# EAGLE design Board1 (EAGLE 7.4.0)
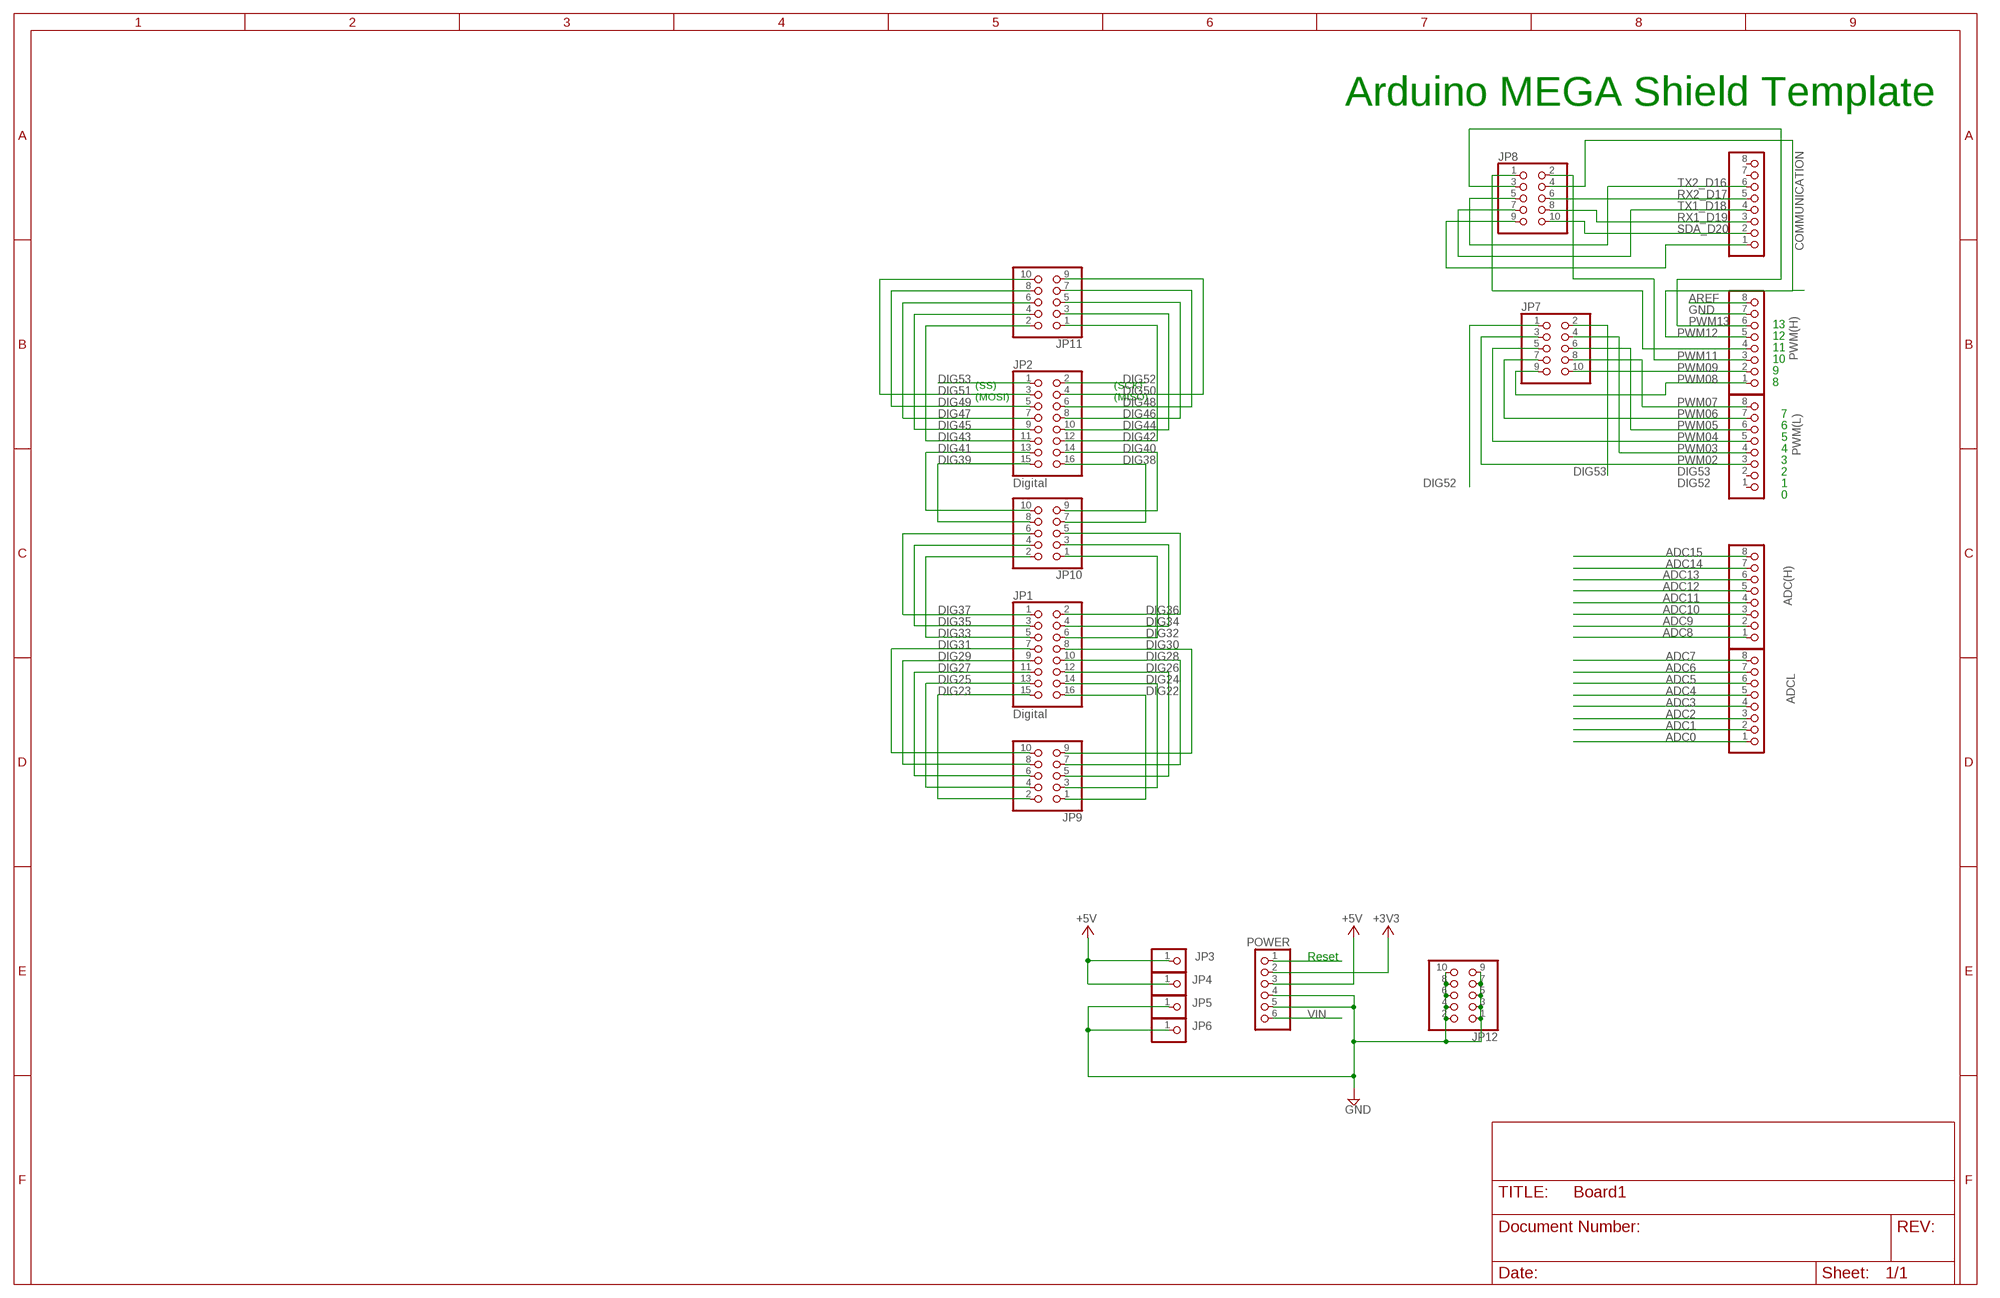
[diagram p0: schematic, sheet 1]

## Parts
ADC(H)  PINHD-1X8  [1X08]
ADCL  PINHD-1X8  [1X08]
COMMUNICATION  PINHD-1X8  [1X08]
JP1  Digital  PINHD-2X8  [2X08]
JP2  Digital  PINHD-2X8  [2X08]
JP3  PINHD-1X1  [1X01]
JP4  PINHD-1X1  [1X01]
JP5  PINHD-1X1  [1X01]
JP6  PINHD-1X1  [1X01]
JP7  PINHD-2X5SMT  [2X05_SMT]
JP8  PINHD-2X5SMT  [2X05_SMT]
JP9  PINHD-2X5SMT  [2X05_SMT]
JP10  PINHD-2X5SMT  [2X05_SMT]
JP11  PINHD-2X5SMT  [2X05_SMT]
JP12  PINHD-2X5SMT  [2X05_SMT]
POWER  PINHD-1X6  [1X06]
PWM(H)  PINHD-1X8  [1X08]
PWM(L)  PINHD-1X8  [1X08]

## Nets
+3V3 [power]: POWER.2
+5V [usbvcc]: JP3.1 JP4.1 POWER.3
ADC0: ADCL.1
ADC1: ADCL.2
ADC2: ADCL.3
ADC3: ADCL.4
ADC4: ADCL.5
ADC5: ADCL.6
ADC6: ADCL.7
ADC7: ADCL.8
ADC8: ADC(H).1
ADC9: ADC(H).2
ADC10: ADC(H).3
ADC11: ADC(H).4
ADC12: ADC(H).5
ADC13: ADC(H).6
ADC14: ADC(H).7
ADC15: ADC(H).8
AREF: PWM(H).8
DIG22: JP1.16 JP9.1
DIG23: JP1.15 JP9.2
DIG24: JP1.14 JP9.3
DIG25: JP1.13 JP9.4
DIG26 [gnd]: JP1.12 JP9.5
DIG27: JP1.11 JP9.6
DIG28: JP1.10 JP9.7
DIG29: JP1.9 JP9.8
DIG30: JP1.8 JP9.9
DIG31: JP1.7 JP9.10
DIG32: JP1.6 JP10.1
DIG33: JP1.5 JP10.2
DIG34: JP1.4 JP10.3
DIG35: JP1.3 JP10.4
DIG36: JP1.2 JP10.5
DIG37: JP1.1 JP10.6
DIG38: JP2.16 JP10.7
DIG39: JP2.15 JP10.8
DIG40: JP2.14 JP10.9
DIG41: JP2.13 JP10.10
DIG42: JP2.12 JP11.1
DIG43: JP2.11 JP11.2
DIG44: JP2.10 JP11.3
DIG45: JP2.9 JP11.4
DIG46: JP2.8 JP11.5
DIG47: JP2.7 JP11.6
DIG48: JP2.6 JP11.7
DIG49: JP2.5 JP11.8
DIG50: JP2.4 JP11.9
DIG51: JP2.3 JP11.10
DIG52: JP2.2 JP7.1
DIG53: JP2.1 JP7.2
GND [gnd]: JP5.1 JP6.1 JP12.1 JP12.2 JP12.3 JP12.4 JP12.5 JP12.6 JP12.7 JP12.8 JP12.9 JP12.10 POWER.4 POWER.5 PWM(H).7
N$1: COMMUNICATION.2 JP8.10
PWM02: JP7.3 PWM(L).3
PWM03: JP7.4 PWM(L).4
PWM04: JP7.5 PWM(L).5
PWM05: JP7.6 PWM(L).6
PWM06: JP7.7 PWM(L).7
PWM07: JP7.8 PWM(L).8
PWM08: JP7.9 PWM(H).1
PWM09: JP7.10 PWM(H).2
PWM10: JP8.1 PWM(H).4
PWM11: JP8.2 PWM(H).3
PWM12: JP8.4 PWM(H).5
PWM13: JP8.3 PWM(H).6
RESET: POWER.1
RX1_D19: COMMUNICATION.3 JP8.8
RX2_D17: COMMUNICATION.5 JP8.6
SDA_D20: COMMUNICATION.1 JP8.9
TX1_D18: COMMUNICATION.4 JP8.7
TX2_D16: COMMUNICATION.6 JP8.5
VIN [power]: POWER.6
Unconnected: COMMUNICATION.7 COMMUNICATION.8 PWM(L).1 PWM(L).2

## Notes on the sheet
- Arduino MEGA Shield Template
- 13
- 12
- 11
- 10
- 9
- (SS) | (SCK) | 8
- (MOSI) | (MISO)
- 7
- 6
- 5
- 4
- 3
- 2
- 1
- 0
- Reset

## Library data of the parts
ADC(H) ADCL COMMUNICATION PWM(H) PWM(L) = pinhead:PINHD-1X8: PIN HEADER
JP1 JP2 = pinhead:PINHD-2X8: PIN HEADER
JP3-JP6 = pinhead:PINHD-1X1: PIN HEADER
JP7-JP12 = pinhead+:PINHD-2X5: PIN HEADER
POWER = pinhead:PINHD-1X6: PIN HEADER

## Net classes
0 default: width 0.203 mm, drill 0.406 mm, clearance 0.203 mm
1 power: width 0.203 mm, drill 0.711 mm, clearance 0.203 mm
2 gnd: width 0.203 mm, drill 0.711 mm, clearance 0.203 mm
3 usbvcc: width 0.203 mm, drill 0.711 mm, clearance 0.203 mm

## Board
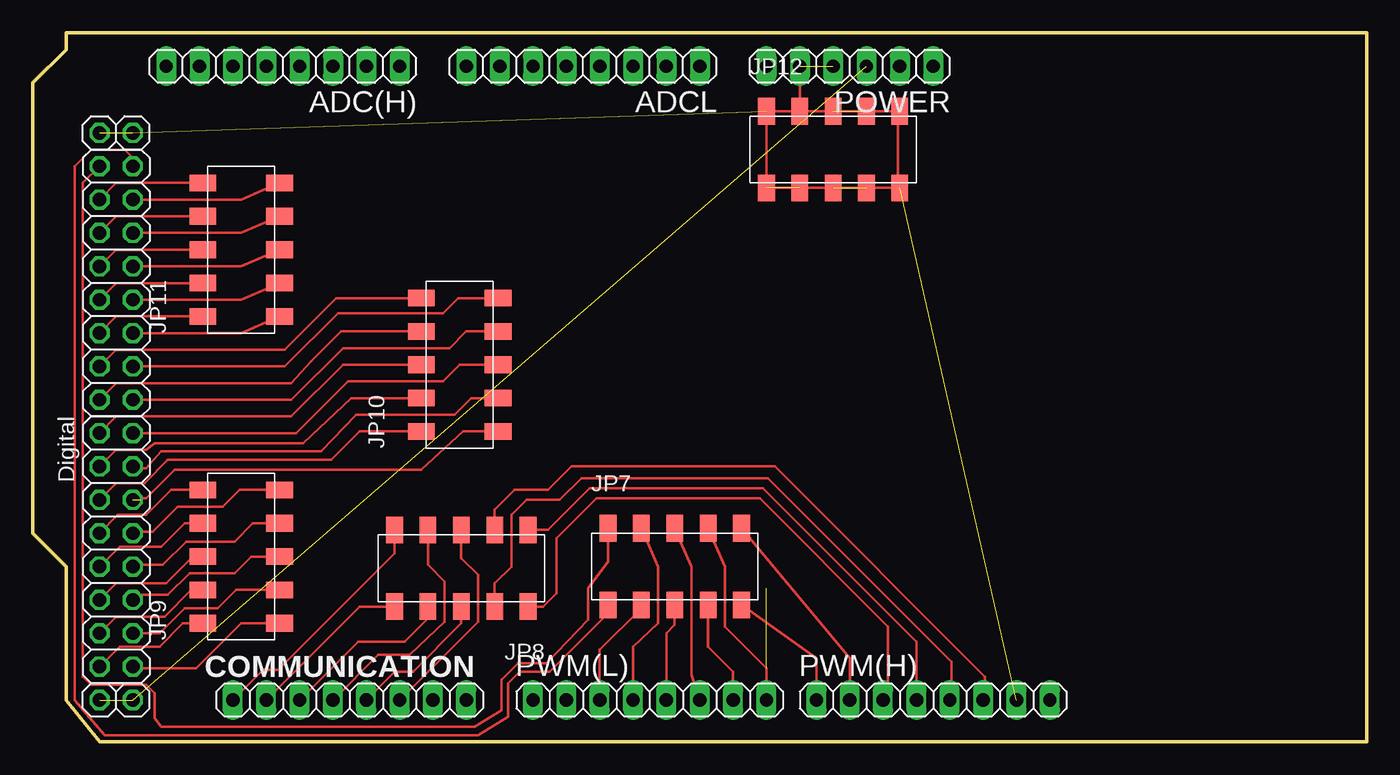
[diagram p1: board, top side]

Size 101.6 x 53.98 mm. Coordinates in mm from the lower left corner, seen from the top.
Outline: 101.6,0 5.08,0 2.54,3.17 2.54,13.33 0,15.88 0,50.16 2.54,52.7 2.54,53.98 101.6,53.98 101.6,0
Copper layers (1*16): Top 0.035mm / dielectric 1.5mm / Bottom 0.035mm
Design rules "fab": minimum track width 0.3mm, minimum drill 32mil, track to track 0.397mm, track to pad 0.397mm, pad to pad 0.397mm, via to via 0.397mm, smd to smd 0.315mm, copper to edge 40mil, drill to drill 16mil, minimum pad ring 10mil, minimum via ring 8mil, stop-mask expansion 4mil, vias tented up to drill 0mil, thermal gap 10mil

### Footprints (pad centres in the part's own frame; a part is rotated, then mirrored left to right if it is on the bottom)
1X08 = drill 1.016 long: 1 -8.89,0; 2 -6.35,0; 3 -3.81,0; 4 -1.27,0; 5 1.27,0; 6 3.81,0; 7 6.35,0; 8 8.89,0
2X08 = drill 1.016 octagon: 1 -8.89,-1.27; 2 -8.89,1.27; 3 -6.35,-1.27; 4 -6.35,1.27; 5 -3.81,-1.27; 6 -3.81,1.27; 7 -1.27,-1.27; 8 -1.27,1.27; 9 1.27,-1.27; 10 1.27,1.27; 11 3.81,-1.27; 12 3.81,1.27; 13 6.35,-1.27; 14 6.35,1.27; 15 8.89,-1.27; 16 8.89,1.27
1X01 = drill 1.016 octagon: 1 0,0
2X05_SMT = smd 1.27 x 2.032: 1 -5.08,-2.921; 2 -5.08,2.921; 3 -2.54,-2.921; 4 -2.54,2.921; 5 0,-2.921; 6 0,2.921; 7 2.54,-2.921; 8 2.54,2.921; 9 5.08,-2.921; 10 5.08,2.921
1X06 = drill 1.016 long: 1 -6.35,0; 2 -3.81,0; 3 -1.27,0; 4 1.27,0; 5 3.81,0; 6 6.35,0

### Placement (x,y rotation side)
ADC(H)  19.05,51.43 180 top
ADCL  41.91,51.43 180 top
COMMUNICATION  24.13,3.17 0 top
JP1  6.35,14.61 270 top
JP2  6.35,34.92 270 top
JP3  7.62,3.17 180 top
JP4  5.08,3.17 180 top
JP5  7.62,46.35 180 top
JP6  5.08,46.35 180 top
JP7  48.9,13.33 0 top
JP8  32.64,13.21 180 top
JP9  15.88,14.1 90 top
JP10  32.51,28.7 90 top
JP11  15.88,37.46 90 top
JP12  60.96,45.09 0 top
POWER  62.23,51.43 180 top
PWM(H)  68.58,3.17 0 top
PWM(L)  46.99,3.17 0 top

### Tracks (layer width: path | path; a pad name or v marks a point on that pad's centre or on a via)
+5V  (2 unrouted)
DIG22
  Top 0.203: JP9.1 15.88,9.02 12.45,5.59 7.75,5.59 JP1.16
DIG23
  Top 0.203: JP9.2 11.43,9.02 9.65,7.24 6.6,7.24 JP1.15
DIG24
  Top 0.203: JP9.3 15.49,11.56 14.1,10.16 11.56,10.16 9.65,8.26 JP1.14
DIG25
  Top 0.203: JP9.4 12.06,11.56 10.03,9.53 6.35,9.53 JP1.13
DIG26
  Top 0.203: JP9.5 16.64,14.1 15.37,12.83 11.94,12.83 10.29,11.18 8,11.18 JP1.12
DIG27
  Top 0.203: JP9.6 12.19,14.1 10.16,12.06 6.35,12.06 JP1.11
DIG28
  Top 0.203: JP9.7 16.76,16.64 15.37,15.24 11.68,15.24 9.91,13.46 7.75,13.46 JP1.10
DIG29
  Top 0.203: JP9.8 11.56,16.64 9.78,14.86 6.6,14.86 JP1.9
DIG30
  Top 0.203: JP9.9 15.75,19.18 14.48,17.91 11.05,17.91 9.14,16 7.75,16 JP1.8
DIG31
  Top 0.203: JP9.10 10.54,19.18 8.64,17.27 6.48,17.27 JP1.7
DIG32  (1 unrouted)
  Top 0.203: JP10.1 32.77,23.62 29.59,20.7 10.79,20.7 8.64,18.54 7.75,18.54 JP1.6
DIG33
  Top 0.203: JP10.2 24.89,23.62 22.73,21.46 10.29,21.46 8.51,19.69 6.35,19.69 JP1.5
DIG34
  Top 0.203: JP10.3 33.4,26.16 32.13,24.89 24.64,24.89 21.97,22.1 9.78,22.1 8.64,20.83 7.75,20.83 JP1.4
DIG35
  Top 0.203: JP1.3 6.35,22.23 8.64,22.23 9.27,22.73 20.57,22.73 24.26,26.16 JP10.4
DIG36
  Top 0.203: JP10.5 32.51,28.7 31.24,27.43 24,27.43 20.07,23.5 JP1.2
DIG37
  Top 0.203: JP1.1 6.35,24.77 19.68,24.77 23.62,28.7 JP10.6
DIG38
  Top 0.203: JP2.16 19.68,26.04 23.62,29.97 31.75,29.97 33.02,31.24 JP10.7
DIG39
  Top 0.203: JP2.15 6.35,27.31 19.68,27.31 21.21,28.96 23.5,31.24 JP10.8
DIG40
  Top 0.203: JP10.9 32.38,33.78 31.24,32.64 23.24,32.64 19.18,28.58 JP2.14
DIG41
  Top 0.203: JP2.13 6.35,29.85 19.18,29.85 23.11,33.78 JP10.10
DIG42
  Top 0.203: JP2.12 15.88,31.12 JP11.1
DIG43
  Top 0.203: JP2.11 6.35,32.38 JP11.2
DIG44
  Top 0.203: JP2.10 15.88,33.66 JP11.3
DIG45
  Top 0.203: JP2.9 6.35,34.92 JP11.4
DIG46
  Top 0.203: JP2.8 15.88,36.2 JP11.5
DIG47
  Top 0.203: JP2.7 6.35,37.46 JP11.6
DIG48
  Top 0.203: JP2.6 15.88,38.73 JP11.7
DIG49
  Top 0.203: JP2.5 6.35,40 JP11.8
DIG50
  Top 0.203: JP2.4 15.88,41.27 JP11.9
DIG51
  Top 0.203: JP2.3 6.35,42.54 JP11.10
DIG52
  Top 0.203: JP2.2 7.62,44.45 6.99,45.09 4.45,45.09 3.17,43.81 3.17,3.17 5.46,0.51 33.91,0.51 36.2,1.91 36.2,4.45 37.08,5.33 39.37,5.33 43.81,9.78 JP7.1
DIG53
  Top 0.203: JP2.1 3.81,42.54 3.81,4.95 4.45,4.32 8.64,4.32 9.27,3.68 9.27,1.78 9.78,1.14 33.66,1.14 35.69,2.41 35.69,4.7 36.96,5.97 39.12,5.97 42.29,9.27 42.29,11.68 43.81,13.72 JP7.2
GND  (7 unrouted)
  Top 0.203: JP12.4 JP12.2 55.88,42.29 | JP12.4 JP12.8 | JP12.1 JP12.7 JP12.9 65.91,42.29 65.91,47.75 65.66,48.01 JP12.8 | JP12.10 65.91,48.01 65.91,48.13 66.04,48.13 JP12.10 | POWER.5 JP12.4 | JP12.8 JP12.10
N$1
  Top 0.203: JP8.10 24.89,10.29 COMMUNICATION.2
PWM02
  Top 0.203: PWM(L).3 43.18,6.98 46.35,10.16 JP7.3
PWM03
  Top 0.203: PWM(L).4 45.72,7.24 47.62,9.02 47.62,13.33 JP7.4
PWM04
  Top 0.203: PWM(L).5 48.26,8.26 48.9,8.89 JP7.5
PWM05
  Top 0.203: PWM(L).6 50.16,5.08 50.16,13.33 JP7.6
PWM06
  Top 0.203: 51.44,10.79 JP7.7 51.44,7.24 53.34,5.33 PWM(L).7
PWM07  (1 unrouted)
  Top 0.203: PWM(L).8 55.88,5.59 52.7,8.76 52.7,13.33 JP7.8
PWM08
  Top 0.203: PWM(H).1 59.69,6.35 JP7.9
PWM09
  Top 0.203: PWM(H).2 62.23,6.35 JP7.10
PWM10
  Top 0.203: JP8.1 39.24,16.13 42.42,19.3 55.63,19.3 67.31,7.62 PWM(H).4
PWM11
  Top 0.203: JP8.2 38.86,10.29 39.88,11.3 39.88,15.49 42.93,18.54 55.37,18.54 65.15,8.76 65.15,3.56 PWM(H).3
PWM12
  Top 0.203: JP8.4 35.18,12.06 36.45,13.33 36.45,17.27 37.59,18.42 40.13,18.42 41.78,20.07 56.01,20.07 69.98,6.1 69.98,3.3 PWM(H).5
PWM13
  Top 0.203: JP8.3 35.18,17.65 36.7,19.18 39.24,19.18 41.02,20.96 56.52,20.96 72.52,4.95 72.52,3.3 PWM(H).6
RX1_D19
  Top 0.203: JP8.8 30.1,9.4 28.32,7.62 24.77,7.62 COMMUNICATION.3
RX2_D17
  Top 0.203: JP8.6 32.64,9.02 28.96,5.33 27.56,5.33 COMMUNICATION.5
SDA_D20
  Top 0.203: JP8.9 27.56,14.35 18.67,5.46 17.53,5.46 COMMUNICATION.1
TX1_D18
  Top 0.203: JP8.7 30.1,13.46 31.37,12.19 31.37,9.14 28.7,6.6 26.29,6.6 COMMUNICATION.4
TX2_D16
  Top 0.203: JP8.5 32.64,13.97 33.91,12.7 33.91,9.14 COMMUNICATION.6